# Altium schematic sheet D2000_micro.SchDoc: Intel D2000 Target
size Letter; Organization: NewAE Technology Inc.; Address1: 1083 Queen St., Suite 196; Address2: Halifax; Address3: NS; Address4: Canada B3H 0B2; SheetApproved: YES
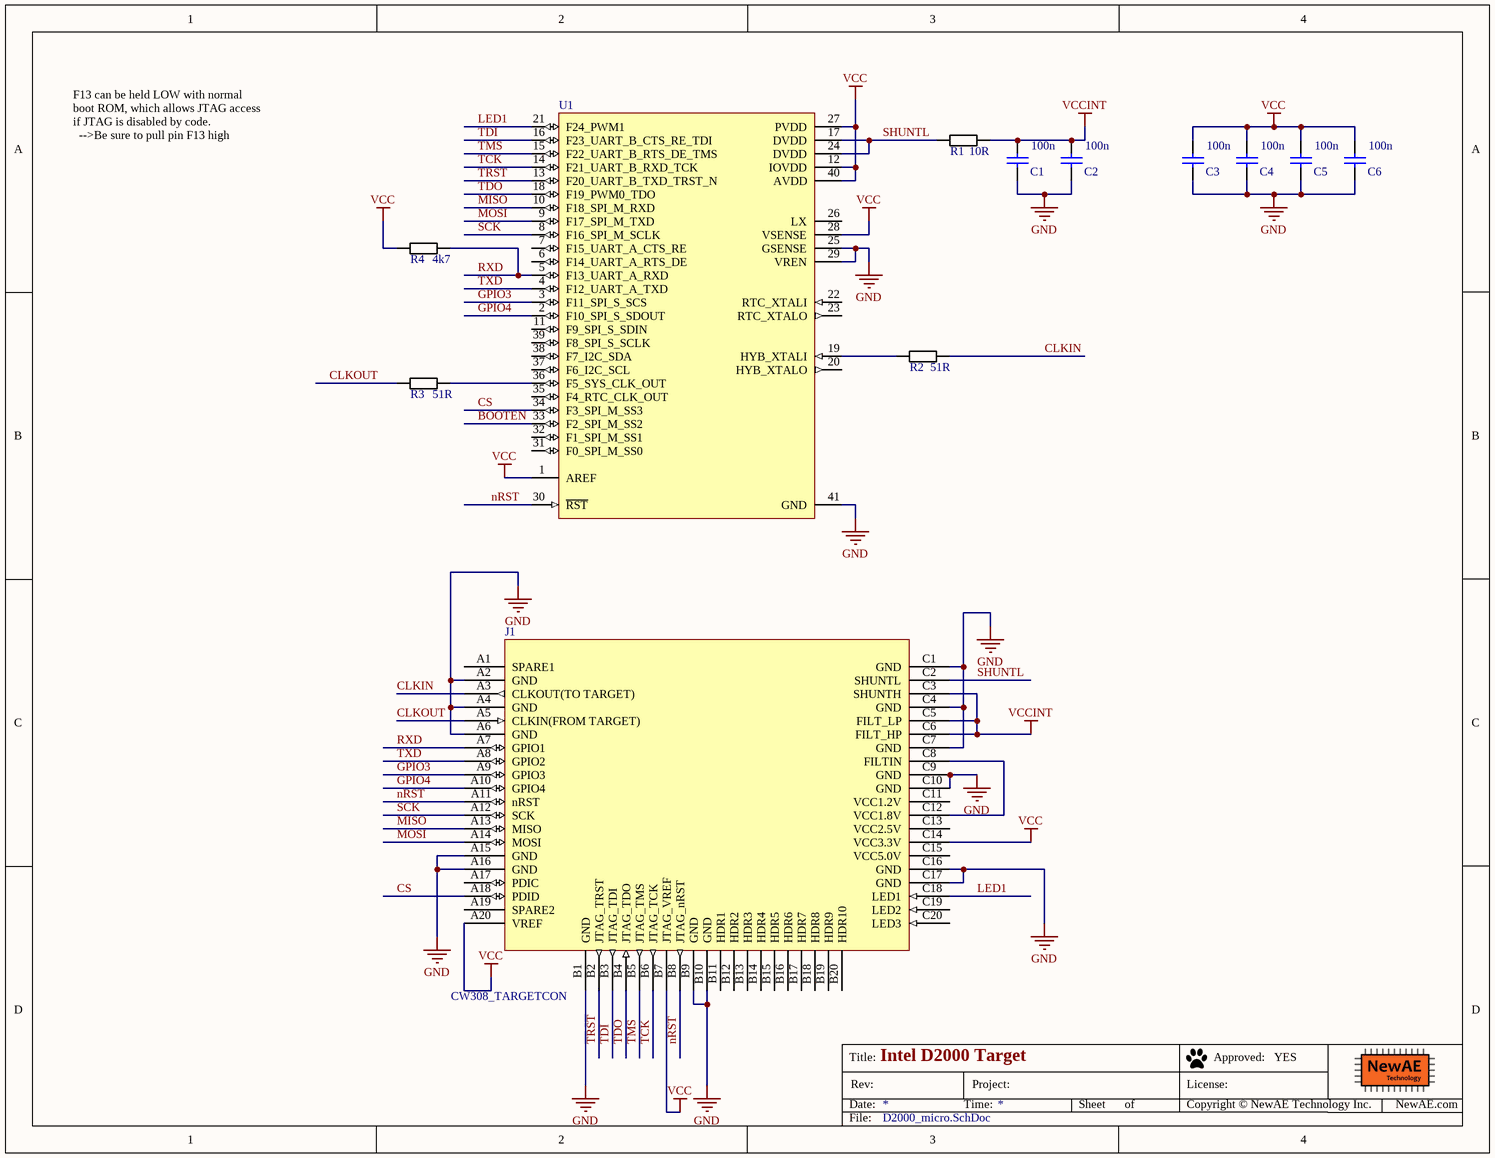
[diagram p0: D2000_micro.SchDoc]

## Parts
C1  100n  [CAPC0603_M]
C2  100n  [CAPC0603_M]
C3  100n  [CAPC0603_M]
C4  100n  [CAPC0603_M]
C5  100n  [CAPC0603_M]
C6  100n  [CAPC0603_M]
J1  CW308_TARGETCON  [CW308_TBOARD_CONN]
R1  10R  [RESC1608X55N]
R2  51R  [RESC1608X55N]
R3  51R  [RESC1608X55N]
R4  4k7  [RESC1608X55N]
U1  FND2000  [QFN50P595X595X90_HS-41M]  (value not drawn)

## Nets
GND: C1.2 C2.2 C3.2 C4.2 C5.2 C6.2 J1.A2(GND) J1.A4(GND) J1.A6(GND) J1.A15(GND) J1.A16(GND) J1.B1(GND) J1.B9(GND) J1.B10(GND) J1.C1(GND) J1.C4(GND) J1.C7(GND) J1.C9(GND) J1.C10(GND) J1.C16(GND) J1.C17(GND) U1.25(GSENSE) U1.29(VREN) U1.41(GND)
VCC: C3.1 C4.1 C5.1 C6.1 J1.A20(VREF) J1.B7(JTAG_VREF) J1.C14(VCC3.3V) R4.1 U1.1(AREF) U1.12(IOVDD) U1.27(PVDD) U1.28(VSENSE) U1.40(AVDD)
VCCINT: C1.1 C2.1 J1.C3(SHUNTH) J1.C5(FILT_LP) J1.C6(FILT_HP) R1.2
BOOTEN: U1.33(F2_SPI_M_SS2)
CLKIN: J1.A3(CLKOUT(TO_TARGET)) R2.2
CLKOUT: J1.A5(CLKIN(FROM_TARGET)) R3.1
CS: J1.A18(PDID) U1.34(F3_SPI_M_SS3)
GPIO3: J1.A9(GPIO3) U1.3(F11_SPI_S_SCS)
GPIO4: J1.A10(GPIO4) U1.2(F10_SPI_S_SDOUT)
LED1: J1.C18(LED1) U1.21(F24_PWM1)
MISO: J1.A13(MISO) U1.10(F18_SPI_M_RXD)
MOSI: J1.A14(MOSI) U1.9(F17_SPI_M_TXD)
nRST: J1.A11(nRST) J1.B8(JTAG_nRST) U1.30(~{RST})
RXD: J1.A7(GPIO1) R4.2 U1.5(F13_UART_A_RXD)
SCK: J1.A12(SCK) U1.8(F16_SPI_M_SCLK)
SHUNTL: J1.C2(SHUNTL) R1.1 U1.17(DVDD) U1.24(DVDD)
TCK: J1.B6(JTAG_TCK) U1.14(F21_UART_B_RXD_TCK)
TDI: J1.B3(JTAG_TDI) U1.16(F23_UART_B_CTS_RE_TDI)
TDO: J1.B4(JTAG_TDO) U1.18(F19_PWM0_TDO)
TMS: J1.B5(JTAG_TMS) U1.15(F22_UART_B_RTS_DE_TMS)
TRST: J1.B2(JTAG_TRST) U1.13(F20_UART_B_TXD_TRST_N)
TXD: J1.A8(GPIO2) U1.4(F12_UART_A_TXD)
NetJ1_C8: J1.C8(FILTIN) J1.C12(VCC1.8V)
NetR2_1: R2.1 U1.19(HYB_XTALI)
NetR3_2: R3.2 U1.36(F5_SYS_CLK_OUT)

Not connected (* = marked no-connect by the designer): J1 A1(SPARE1) A17(PDIC) A19(SPARE2) B11(HDR1) B12(HDR2) B13(HDR3) B14(HDR4) B15(HDR5) B16(HDR6) B17(HDR7) B18(HDR8) B19(HDR9) B20(HDR10) C11(VCC1.2V) C13(VCC2.5V) C15(VCC5.0V) C19(LED2) C20(LED3); U1 6(F14_UART_A_RTS_DE) 7(F15_UART_A_CTS_RE) 11(F9_SPI_S_SDIN) 20(HYB_XTALO) 22(RTC_XTALI) 23(RTC_XTALO) 26(LX) 31(F0_SPI_M_SS0) 32(F1_SPI_M_SS1) 35(F4_RTC_CLK_OUT) 37(F6_I2C_SCL) 38(F7_I2C_SDA) 39(F8_SPI_S_SCLK)

## Notes on the sheet
- F13 can be held LOW with normal boot ROM, which allows JTAG access if JTAG is disabled by code.
  -->Be sure to pull pin F13 high (normally happens if TX/RX configured correctly)
- Title:
- Date:
- Rev:
- Time:
- Project:
- Sheet
- of
- License:
- Copyright © NewAE Technology Inc.
- Approved:
- NewAE.com
- File:

## Library data of the parts
C1-C6 = CCHIP-100n-0603: 100n, 0603; Case-EIA: 0603; Case-Metric: 1608; Part Number: CCHIP-100n-0603; Component Kind: Standard; Component Type: Standard; Footprint: 0603; Pin Count: 2; Value: 100n; Mounting Technology: Surface Mount
J1 = CW308_TBOARD: CW308 "Standard" Target Board Connector
R1 = RCHIP-10R-0603: 10R, 0603; Case-EIA: 0603; Case-Metric: 1608; Part Number: RCHIP-10R-0603; Component Kind: Standard; Component Type: Standard; Footprint: 0603; Pin Count: 2; Value: 10R; Mounting Technology: Surface Mount
R2 R3 = RCHIP-51R-0603: 51R, 0603; Case-EIA: 0603; Case-Metric: 1608; Part Number: RCHIP-51R-0603; Component Kind: Standard; Component Type: Standard; Footprint: 0603; Pin Count: 2; Value: 51R; Mounting Technology: Surface Mount
R4 = RCHIP-4K7-0603: 4k7 res, 0603, 1%, 1/10W; Manufacture 1: Yageo; Manufacture Part Number 1: RC0603FR-074K7L; Case-EIA: 0603; Case-Metric: 1608; Rated Power: 0.1W; Rated Voltage: 75VDC; Part Number: RCHIP-4K7-0603; Component Kind: Standard; Component Type: Standard; Footprint: 0603; Pin Count: 2; Supplier 1: Digi-Key; Supplier Part Number 1: 311-4.70KHRCT-ND; Value: 4k7; Tolerance: 1%; Mounting Technology: SMT; Temperature Range: -55C to 155C
U1 = D2000: Intel x86 microcontroller; Manufacture Part Number 1: FND2000 S R2KF; Part Number: D2000; Component Kind: Standard; Component Type: Standard; Manufacture 1: Intel; Pin Count: 41; Supplier 1: Arrow